# EAGLE schematic esplash (EAGLE 9.6.2)
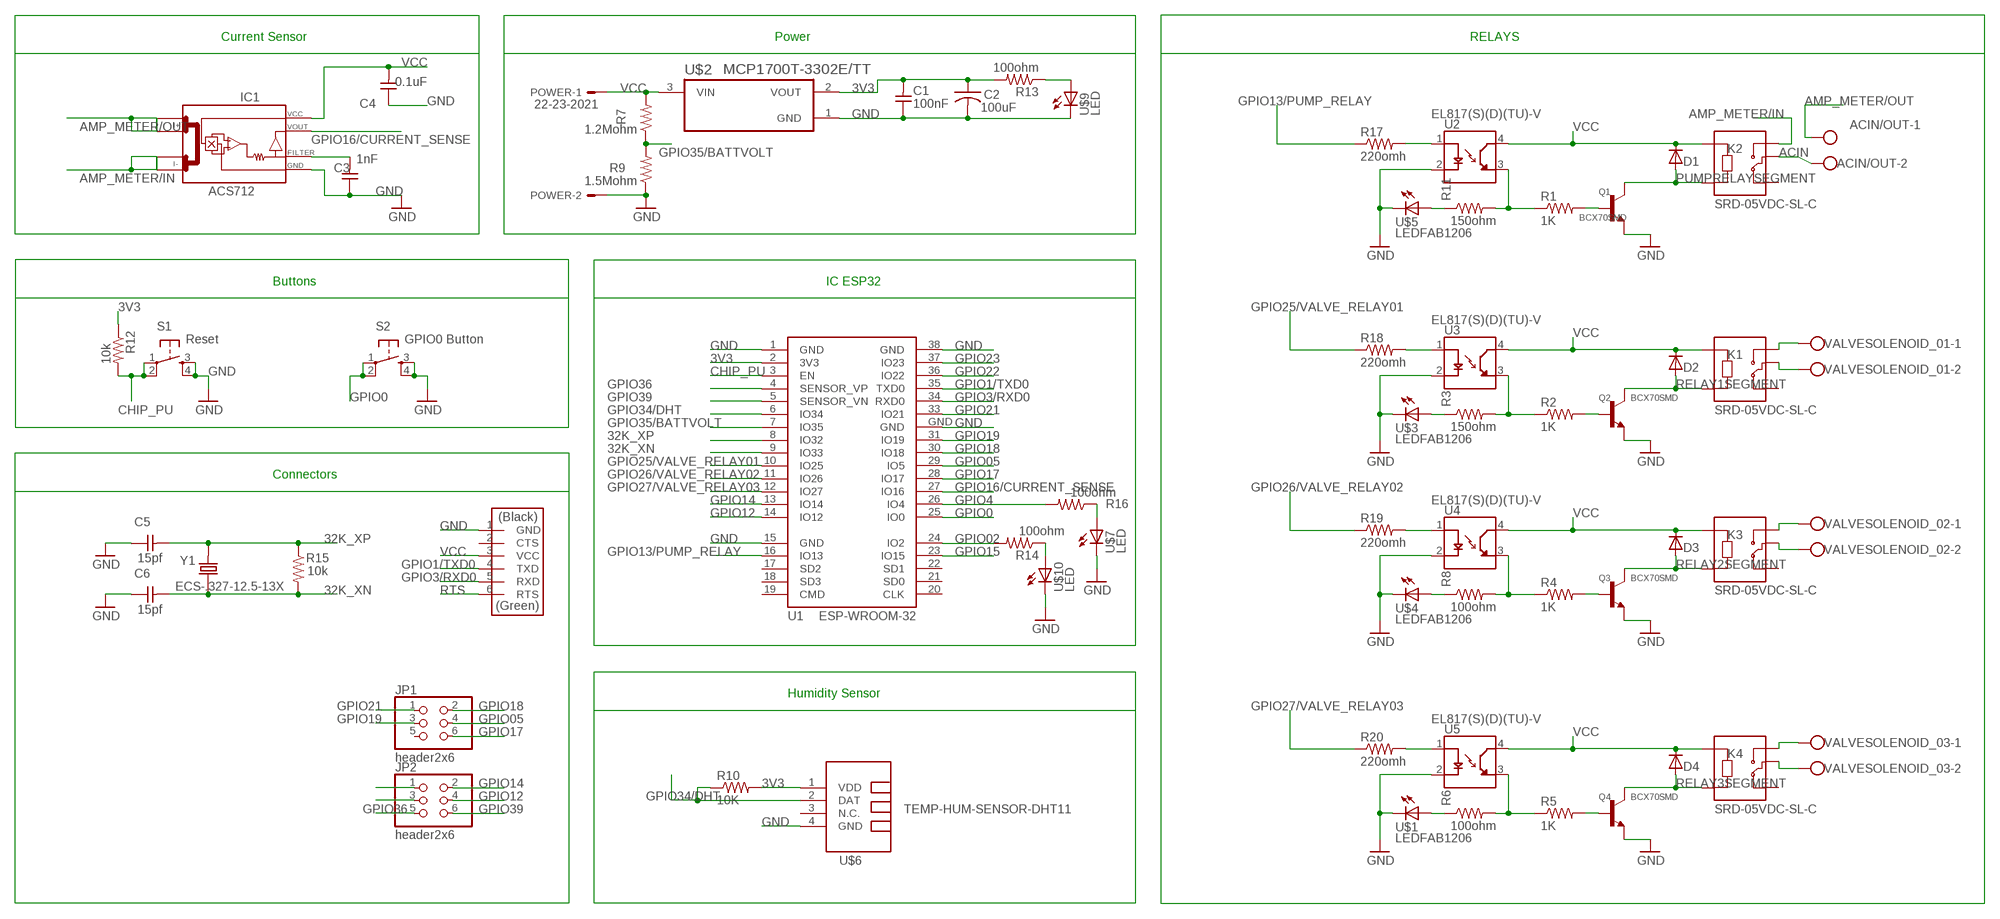
[diagram p0: schematic, sheet 1]

## Parts
ACIN/OUT  W237-102  [W237-102]
C1  100nF  CAP-UNPOLARIZEDFAB  [C1206FAB]
C2  100uF  CAP-US1206FAB  [C1206FAB]
C3  1nF  CAP-UNPOLARIZEDFAB  [C1206FAB]
C4  0.1uF  CAP-UNPOLARIZEDFAB  [C1206FAB]
C5  15pf  CAP-UNPOLARIZEDFAB  [C1206FAB]
C6  15pf  CAP-UNPOLARIZEDFAB  [C1206FAB]
D1  DIODESOD123  [SOD123]
D2  DIODESOD123  [SOD123]
D3  DIODESOD123  [SOD123]
D4  DIODESOD123  [SOD123]
IC1  ACS712  [SO08]
JP1  header2x6  PINHD-2X3  [2X03]
JP2  header2x6  PINHD-2X3  [2X03]
K1  SRD-05VDC-SL-C  [RELAY_SRD-05VDC-SL-C]
K2  SRD-05VDC-SL-C  [RELAY_SRD-05VDC-SL-C]
K3  SRD-05VDC-SL-C  [RELAY_SRD-05VDC-SL-C]
K4  SRD-05VDC-SL-C  [RELAY_SRD-05VDC-SL-C]
POWER  22-23-2021  [22-23-2021]
Q1  BCX70SMD  [SOT23]
Q2  BCX70SMD  [SOT23]
Q3  BCX70SMD  [SOT23]
Q4  BCX70SMD  [SOT23]
R1  1K  RES-US1206FAB  [R1206FAB]
R2  1K  RES-US1206FAB  [R1206FAB]
R3  150ohm  RES-US1206FAB  [R1206FAB]
R4  1K  RES-US1206FAB  [R1206FAB]
R5  1K  RES-US1206FAB  [R1206FAB]
R6  100ohm  RES-US1206FAB  [R1206FAB]
R7  1.2Mohm  RES-US1206FAB  [R1206FAB]
R8  100ohm  RES-US1206FAB  [R1206FAB]
R9  1.5Mohm  RES-US1206FAB  [R1206FAB]
R10  10K  RES-US1206FAB  [R1206FAB]
R11  150ohm  RES-US1206FAB  [R1206FAB]
R12  10k  RES-US1206  [R1206]
R13  100ohm  RES-US1206  [R1206]
R14  100ohm  RES-US1206  [R1206]
R15  10k  RES-US1206  [R1206]
R16  100ohm  RES-US1206  [R1206]
R17  220omh  RES-US1206FAB  [R1206FAB]
R18  220omh  RES-US1206FAB  [R1206FAB]
R19  220omh  RES-US1206FAB  [R1206FAB]
R20  220omh  RES-US1206FAB  [R1206FAB]
RTS  FTDI-SMD-HEADER  [1X06SMD]
S1  Reset  6MM_SWITCH6MM_SWITCH  [6MM_SWITCH]
S2  GPIO0 Button  6MM_SWITCH6MM_SWITCH  [6MM_SWITCH]
U1  ESP-WROOM-32  [ESP-WROOM-32]
U2  EL817(S)(D)(TU)-V  [SOIC254P1030X460-4N]
U3  EL817(S)(D)(TU)-V  [SOIC254P1030X460-4N]
U4  EL817(S)(D)(TU)-V  [SOIC254P1030X460-4N]
U5  EL817(S)(D)(TU)-V  [SOIC254P1030X460-4N]
U$1  LEDFAB1206  [LED1206FAB]
U$2  MCP1700T-3302E/TT  [SOT95P237X112-3N]
U$3  LEDFAB1206  [LED1206FAB]
U$4  LEDFAB1206  [LED1206FAB]
U$5  LEDFAB1206  [LED1206FAB]
U$6  TEMP-HUM-SENSOR-DHT11  [TEMP-HUM-SENSOR-DHT11]
U$7  LED  [LED1206]
U$9  LED  [LED1206]
U$10  LED  [LED1206]
VALVESOLENOID_01  W237-102  [W237-102]
VALVESOLENOID_02  W237-102  [W237-102]
VALVESOLENOID_03  W237-102  [W237-102]
Y1  ECS-.327-12.5-13X  [XTAL_ECS-.327-12.5-13X]

## Nets
3V3: C1.2 C2.1 R10.2 R12.1 R13.2 U1.2(3V3) U$2.2(VOUT) U$6.1(VDD)
32K_XN: C6.2 R15.2 U1.9(IO33) Y1.1
32K_XP: C5.2 R15.1 U1.8(IO32) Y1.2
ACIN: ACIN/OUT.2 K2.COM
AMP_METER/IN: IC1.3(I-_0) IC1.4(I-_1) K2.NO
AMP_METER/OUT: ACIN/OUT.1 IC1.1(I+_0) IC1.2(I+_1)
CHIP_PU: R12.2 S1.1(P) S1.2(P1) U1.3(EN)
DELETE: C3.2 IC1.6(FILTER)
GND: C1.1 C2.2 C3.1 C4.1 C5.1 C6.1 IC1.5(GND) POWER.2 Q1.2(E) Q2.2(E) Q3.2(E) Q4.2(E) R9.1 RTS.1(GND) S1.3(S) S1.4(S1) S2.3(S) S2.4(S1) U1.1(GND) U1.15(GND) U1.38(GND) U1.GND U2.2(C) U3.2(C) U4.2(C) U5.2(C) U$1.2(C) U$2.1(GND) U$3.2(C) U$4.2(C) U$5.2(C) U$6.4(GND) U$7.2(C) U$9.2(C) U$10.2(C)
GPIO0: S2.1(P) S2.2(P1) U1.25(IO0)
GPIO1/TXD0: RTS.4(TXD) U1.35(TXD0)
GPIO02: R14.2 U1.24(IO2)
GPIO3/RXD0: RTS.5(RXD) U1.34(RXD0)
GPIO4: R16.2 U1.26(IO4)
GPIO05: JP1.4 U1.29(IO5)
GPIO12: JP2.4 U1.14(IO12)
GPIO13/PUMP_RELAY: R17.1 U1.16(IO13)
GPIO14: JP2.2 U1.13(IO14)
GPIO15: U1.23(IO15)
GPIO16/CURRENT_SENSE: IC1.7(VOUT) U1.27(IO16)
GPIO17: JP1.6 U1.28(IO17)
GPIO18: JP1.2 U1.30(IO18)
GPIO19: JP1.3 U1.31(IO19)
GPIO21: JP1.1 U1.33(IO21)
GPIO22: U1.36(IO22)
GPIO23: U1.37(IO23)
GPIO25/VALVE_RELAY01: R18.1 U1.10(IO25)
GPIO26/VALVE_RELAY02: R19.1 U1.11(IO26)
GPIO27/VALVE_RELAY03: R20.1 U1.12(IO27)
GPIO34/DHT: R10.1 U1.6(IO34) U$6.2(DAT)
GPIO35/BATTVOLT: R7.1 R9.2 U1.7(IO35)
GPIO36: JP2.5 U1.4(SENSOR_VP)
GPIO39: JP2.6 U1.5(SENSOR_VN)
N$2: R1.1 R11.2 U2.3(ET)
N$5: K1.COM VALVESOLENOID_01.2
N$7: Q2.1(B) R2.2
N$8: R11.1 U$5.1(A)
N$10: R14.1 U$10.1(A)
N$12: K1.NO VALVESOLENOID_01.1
N$13: R3.1 U$3.1(A)
N$14: R2.1 R3.2 U3.3(ET)
N$15: K3.COM VALVESOLENOID_02.2
N$16: Q3.1(B) R4.2
N$17: R8.1 U$4.1(A)
N$18: R4.1 R8.2 U4.3(ET)
N$19: K3.NO VALVESOLENOID_02.1
N$20: K4.COM VALVESOLENOID_03.2
N$21: Q4.1(B) R5.2
N$22: R6.1 U$1.1(A)
N$23: R5.1 R6.2 U5.3(ET)
N$24: K4.NO VALVESOLENOID_03.1
N$25: R13.1 U$9.1(A)
N$27: JP2.1
N$28: JP2.3
N$29: R16.1 U$7.1(A)
N$30: R17.2 U2.1(A)
N$31: R18.2 U3.1(A)
N$32: R19.2 U4.1(A)
N$33: R20.2 U5.1(A)
N$43: Q1.1(B) R1.2
PUMPRELAYSEGMENT: D1.ANODE(A) K2.A2 Q1.3(C)
RELAY1SEGMENT: D2.ANODE(A) K1.A2 Q2.3(C)
RELAY2SEGMENT: D3.ANODE(A) K3.A2 Q3.3(C)
RELAY3SEGMENT: D4.ANODE(A) K4.A2 Q4.3(C)
RTS: RTS.6(RTS)
VCC: C4.2 D1.CATHODE(C) D2.CATHODE(C) D3.CATHODE(C) D4.CATHODE(C) IC1.8(VCC) K1.A1 K2.A1 K3.A1 K4.A1 POWER.1 R7.2 RTS.3(VCC) U2.4(CT) U3.4(CT) U4.4(CT) U5.4(CT) U$2.3(VIN)
Unconnected: JP1.5 K1.NC K2.NC K3.NC K4.NC RTS.2(CTS) U1.17(SD2) U1.18(SD3) U1.19(CMD) U1.20(CLK) U1.21(SD0) U1.22(SD1) U$6.3(N.C.)

## Notes on the sheet
- Current Sensor | Power | RELAYS
- Buttons | IC ESP32
- Connectors
- Humidity Sensor

## Library data of the parts
ACIN/OUT VALVESOLENOID_01-VALVESOLENOID_03 = con-wago-500:W237-102: WAGO SCREW CLAMP; MPN: 237-102; OC_FARNELL: unknown; OC_NEWARK: 70K9898
C1 C3-C6 = fab:CAP-UNPOLARIZED
C2 = fab:CAP-US
D1-D4 = fab:DIODE: DIODE high speed (Philips)
IC1 = ACS712:ACS712
JP1 JP2 = pinhead:PINHD-2X3: PIN HEADER
K1-K4 = SRD-05VDC-SL-C:SRD-05VDC-SL-C: 5V Trigger Relay Module For Arduino And Raspberry Pi 5V Trigger Relay Module For Arduino And Raspberry Pi; AVAILABILITY: Unavailable; DESCRIPTION: 5V Trigger Relay Module For Arduino And Raspberry Pi 5V Trigger Relay Module For Arduino And Raspberry Pi; MF: Songle Relay; MP: SRD-05VDC-SL-C; PACKAGE: None; PRICE: None
POWER = con-molex:22-23-2021: .100" (2.54mm) Center Header - 2 Pin; MF: MOLEX; MPN: 22-23-2021; OC_FARNELL: 1462926; OC_NEWARK: 25C3832
Q1-Q4 = transistor:BCX70SMD: NPN TRANSISTOR
R1-R20 = fab:RES-US: Resistor (US Symbol) Variants with postfix FAB are widened to allow the routing of internal traces
RTS = fab:FTDI-SMD-HEADER
S1 S2 = fab:6MM_SWITCH: OMRON SWITCH
U1 = esp32:ESP-WROOM-32: Espressif Systems ESP-WROOM-32
U2-U5 = EL817_S__D__TU_-V:EL817(S)(D)(TU)-V: Optocoupler DC-IN 1-CH Transistor DC-OUT 4-Pin PDIP Tube; AVAILABILITY: Unavailable; DESCRIPTION: Optoisolator Transistor Output 5000Vrms 1 Channel 4-SMD; MF: Everlight Electronics; MP: EL817(S)(D)(TU)-V; PACKAGE: SMD-4 Everlight; PRICE: None
U$1 U$3-U$5 U$7 U$9 U$10 = fab:LED: LED
U$2 = MCP1700T-3302E_TT:MCP1700T-3302E/TT; ARROW_AMERICAS-PURCHASE-URL: https://snapeda.com/shop?store=Arrow+Americas&id=4791194; AVAILABILITY: Unavailable; DESCRIPTION: IC REG LINEAR 3.3V 250MA SOT23-3; DIGIKEY-PURCHASE-URL: https://snapeda.com/shop?store=DigiKey&id=4791194; MF: Microchip Technology; MOUSER-PURCHASE-URL: https://snapeda.com/shop?store=Mouser&id=4791194; MP: MCP1700T-3302E/TT; PACKAGE: None; PRICE: None
U$6 = diy-modules:TEMP-HUM-SENSOR-DHT11: DHT11 - digital humidity & temperature sensor DHT11 datasheet available here: https://akizukidenshi.com/download/ds/aosong/DHT11.pdf Click here to find device on ebay.com <http://www.ebay.com/sch/dht11+digital+sensor>
Y1 = ECS-.327-12.5-13X:ECS-.327-12.5-13X: Crystal Cylindrical Can, Radial; AVAILABILITY: Unavailable; DESCRIPTION: 32.768kHz ±20ppm Crystal 12.5pF 35 kOhms Cylindrical Can, Radial; MF: ECS Inc.; MP: ECS-.327-12.5-13X; PACKAGE: Cylindrical Can Radial ECS International; PRICE: None